# Altium schematic sheet communication.SchDoc
size A4
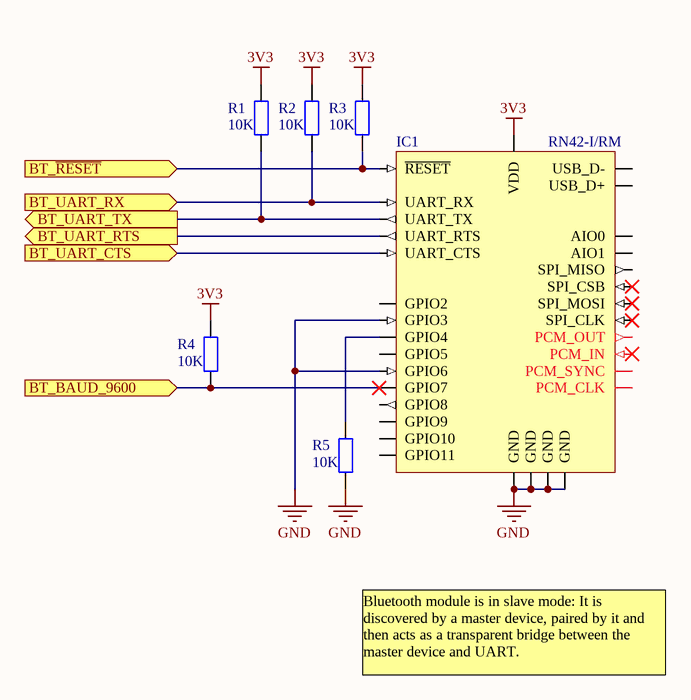
[diagram p0: communication.SchDoc]

## Parts
IC1  RN42-I/RM  [RN42]
R1  10K  [1608[0603]_M]
R2  10K  [1608[0603]_M]
R3  10K  [1608[0603]_M]
R4  10K  [1608[0603]_M]
R5  10K  [1608[0603]_M]

## Ports
BT_BAUD_9600 (in), BT_UART_CTS (in), BT_UART_RTS (out), BT_UART_RX (in), BT_UART_TX (out), BT_~{RESET} (in)

## Nets
3V3: IC1.11(VDD) R1.2 R2.2 R3.2 R4.2
GND: IC1.1(GND) IC1.3(GPIO6) IC1.12(GND) IC1.20(GPIO3) IC1.28(GND) IC1.29(GND) R5.1
BT_BAUD_9600: IC1.4(GPIO7) R4.1 ; port BT_BAUD_9600
BT_~{RESET}: IC1.5(~{RESET}) R3.1 ; port BT_~{RESET}
BT_UART_CTS: IC1.16(UART_CTS) ; port BT_UART_CTS
BT_UART_RTS: IC1.15(UART_RTS) ; port BT_UART_RTS
BT_UART_RX: IC1.13(UART_RX) R2.1 ; port BT_UART_RX
BT_UART_TX: IC1.14(UART_TX) R1.1 ; port BT_UART_TX
NetIC1_22: IC1.22(GPIO4) R5.2

Not connected (* = marked no-connect by the designer): IC1 2(SPI_MOSI)* 6(SPI_CLK)* 7(PCM_CLK) 8(PCM_SYNC) 9(PCM_IN)* 10(PCM_OUT) 17(USB_D+) 18(USB_D-) 19(GPIO2) 21(GPIO5) 23(SPI_CSB)* 24(SPI_MISO) 30(AIO0) 31(GPIO8) 32(GPIO9) 33(GPIO10) 34(GPIO11) 35(AIO1)

## Notes on the sheet
- Bluetooth module is in slave mode: It is discovered by a master device, paired by it and then acts as a transparent bridge between the master device and UART.

## Library data of the parts
IC1 = RN42: Bluetooth 2.1 module
R1-R5 = Resistor: Generic Resistor; Value: 10K